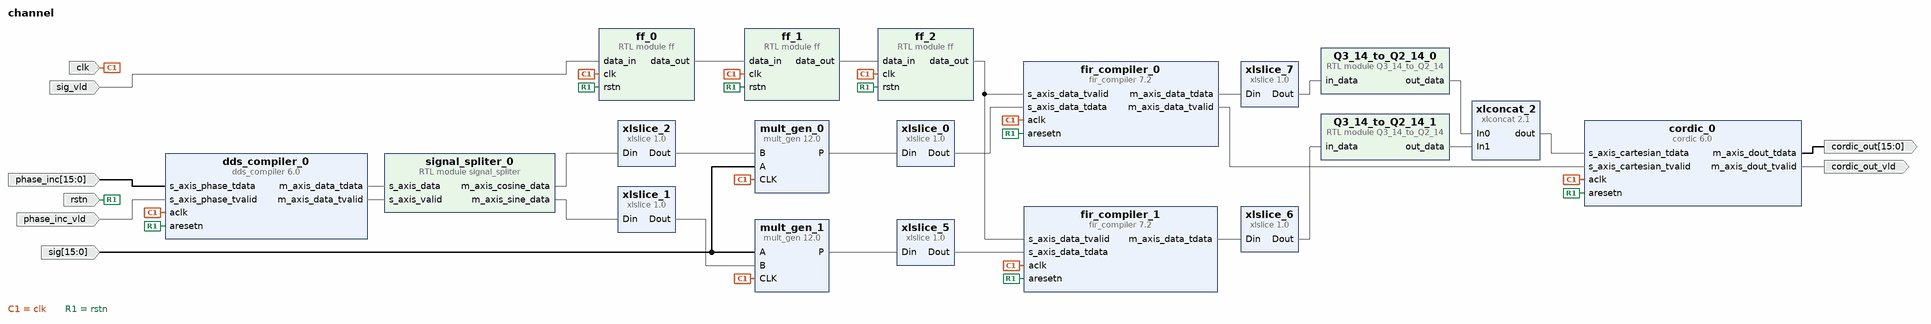
[diagram p0: block diagram of the top level]
# Vivado block design channel, xc7z010clg400-1, Vivado 2020.1
create_bd_design channel

create_bd_port -dir I -from 15 -to 0 phase_inc
create_bd_port -dir I phase_inc_vld
create_bd_port -dir O -from 15 -to 0 cordic_out
create_bd_port -dir O cordic_out_vld
create_bd_port -dir I -from 15 -to 0 sig
create_bd_port -dir I sig_vld
create_bd_port -dir I -type clk clk
set_property -dict {CONFIG.FREQ_HZ 125000000} [get_bd_ports clk]
create_bd_port -dir I -type rst rstn

create_bd_cell -type module -reference Q3_14_to_Q2_14 Q3_14_to_Q2_14_0
create_bd_cell -type module -reference Q3_14_to_Q2_14 Q3_14_to_Q2_14_1
create_bd_cell -type ip -vlnv xilinx.com:ip:cordic:6.0 cordic_0
set_property -dict [list \
  CONFIG.ARESETN true \
  CONFIG.Data_Format SignedFraction \
  CONFIG.Functional_Selection Arc_Tan \
  CONFIG.Input_Width 16 \
] [get_bd_cells cordic_0]
create_bd_cell -type ip -vlnv xilinx.com:ip:dds_compiler:6.0 dds_compiler_0
set_property -dict [list \
  CONFIG.Amplitude_Mode Full_Range \
  CONFIG.DATA_Has_TLAST Not_Required \
  CONFIG.DDS_Clock_Rate 125 \
  CONFIG.Frequency_Resolution 0.4 \
  CONFIG.Has_ACLKEN false \
  CONFIG.Has_ARESETn true \
  CONFIG.Has_Phase_Out false \
  CONFIG.Latency 7 \
  CONFIG.M_DATA_Has_TUSER Not_Required \
  CONFIG.Noise_Shaping None \
  CONFIG.Output_Frequency1 0 \
  CONFIG.Output_Width 16 \
  CONFIG.PINC1 0 \
  CONFIG.Parameter_Entry Hardware_Parameters \
  CONFIG.PartsPresent Phase_Generator_and_SIN_COS_LUT \
  CONFIG.Phase_Increment Streaming \
  CONFIG.Phase_Width 16 \
  CONFIG.S_PHASE_Has_TUSER Not_Required \
  CONFIG.Spurious_Free_Dynamic_Range 45 \
] [get_bd_cells dds_compiler_0]
create_bd_cell -type module -reference ff ff_0
create_bd_cell -type module -reference ff ff_1
create_bd_cell -type module -reference ff ff_2
create_bd_cell -type ip -vlnv xilinx.com:ip:fir_compiler:7.2 fir_compiler_0
set_property -dict [list \
  CONFIG.Channel_Sequence Basic \
  CONFIG.Clock_Frequency 125 \
  CONFIG.CoefficientVector {-0.036879, 0.014709, 0.012419, 0.010714, 0.009481, 0.008588, 0.007977, 0.007579, 0.007363, 0.007260, 0.007271, 0.007359, 0.007498, 0.007690, 0.007919, 0.008172, 0.008453, 0.008745, 0.009054, 0.009364, 0.009690, 0.010011, 0.010340, 0.010664, 0.010988, 0.011300, 0.011615, 0.011917, 0.012221, 0.012515, 0.012810, 0.013089, 0.013361, 0.013616, 0.013858, 0.014084, 0.014309, 0.014512, 0.014717, 0.014903, 0.015075, 0.015222, 0.015355, 0.015478, 0.015558, 0.015693, 0.015748, 0.015798, 0.015861, 0.015870, 0.015873, 0.015870, 0.015861, 0.015798, 0.015748, 0.015693, 0.015558, 0.015478, 0.015355, 0.015222, 0.015075, 0.014903, 0.014717, 0.014512, 0.014309, 0.014084, 0.013858, 0.013616, 0.013361, 0.013089, 0.012810, 0.012515, 0.012221, 0.011917, 0.011615, 0.011300, 0.010988, 0.010664, 0.010340, 0.010011, 0.009690, 0.009364, 0.009054, 0.008745, 0.008453, 0.008172, 0.007919, 0.007690, 0.007498, 0.007359, 0.007271, 0.007260, 0.007363, 0.007579, 0.007977, 0.008588, 0.009481, 0.010714, 0.012419, 0.014709, -0.036879} \
  CONFIG.Coefficient_Fractional_Bits 19 \
  CONFIG.Coefficient_Sets 1 \
  CONFIG.Coefficient_Sign Signed \
  CONFIG.Coefficient_Structure Inferred \
  CONFIG.Coefficient_Width 16 \
  CONFIG.ColumnConfig 40,11 \
  CONFIG.DATA_Has_TLAST Not_Required \
  CONFIG.Data_Fractional_Bits 14 \
  CONFIG.Data_Sign Signed \
  CONFIG.Data_Width 16 \
  CONFIG.Filter_Architecture Systolic_Multiply_Accumulate \
  CONFIG.Has_ARESETn true \
  CONFIG.M_DATA_Has_TUSER Not_Required \
  CONFIG.Number_Channels 1 \
  CONFIG.Output_Rounding_Mode Full_Precision \
  CONFIG.Output_Width 36 \
  CONFIG.Quantization Quantize_Only \
  CONFIG.S_DATA_Has_TUSER Not_Required \
  CONFIG.Sample_Frequency 125 \
  CONFIG.Select_Pattern All \
] [get_bd_cells fir_compiler_0]
create_bd_cell -type ip -vlnv xilinx.com:ip:fir_compiler:7.2 fir_compiler_1
set_property -dict [list \
  CONFIG.Channel_Sequence Basic \
  CONFIG.Clock_Frequency 125 \
  CONFIG.CoefficientVector {-0.036879, 0.014709, 0.012419, 0.010714, 0.009481, 0.008588, 0.007977, 0.007579, 0.007363, 0.007260, 0.007271, 0.007359, 0.007498, 0.007690, 0.007919, 0.008172, 0.008453, 0.008745, 0.009054, 0.009364, 0.009690, 0.010011, 0.010340, 0.010664, 0.010988, 0.011300, 0.011615, 0.011917, 0.012221, 0.012515, 0.012810, 0.013089, 0.013361, 0.013616, 0.013858, 0.014084, 0.014309, 0.014512, 0.014717, 0.014903, 0.015075, 0.015222, 0.015355, 0.015478, 0.015558, 0.015693, 0.015748, 0.015798, 0.015861, 0.015870, 0.015873, 0.015870, 0.015861, 0.015798, 0.015748, 0.015693, 0.015558, 0.015478, 0.015355, 0.015222, 0.015075, 0.014903, 0.014717, 0.014512, 0.014309, 0.014084, 0.013858, 0.013616, 0.013361, 0.013089, 0.012810, 0.012515, 0.012221, 0.011917, 0.011615, 0.011300, 0.010988, 0.010664, 0.010340, 0.010011, 0.009690, 0.009364, 0.009054, 0.008745, 0.008453, 0.008172, 0.007919, 0.007690, 0.007498, 0.007359, 0.007271, 0.007260, 0.007363, 0.007579, 0.007977, 0.008588, 0.009481, 0.010714, 0.012419, 0.014709, -0.036879} \
  CONFIG.Coefficient_Fractional_Bits 19 \
  CONFIG.Coefficient_Sets 1 \
  CONFIG.Coefficient_Sign Signed \
  CONFIG.Coefficient_Structure Inferred \
  CONFIG.Coefficient_Width 16 \
  CONFIG.ColumnConfig 40,11 \
  CONFIG.DATA_Has_TLAST Not_Required \
  CONFIG.Data_Fractional_Bits 14 \
  CONFIG.Data_Sign Signed \
  CONFIG.Data_Width 16 \
  CONFIG.Filter_Architecture Systolic_Multiply_Accumulate \
  CONFIG.Has_ARESETn true \
  CONFIG.M_DATA_Has_TUSER Not_Required \
  CONFIG.Number_Channels 1 \
  CONFIG.Output_Rounding_Mode Full_Precision \
  CONFIG.Output_Width 36 \
  CONFIG.Quantization Quantize_Only \
  CONFIG.S_DATA_Has_TUSER Not_Required \
  CONFIG.Sample_Frequency 125 \
  CONFIG.Select_Pattern All \
] [get_bd_cells fir_compiler_1]
create_bd_cell -type ip -vlnv xilinx.com:ip:mult_gen:12.0 mult_gen_0
set_property -dict [list \
  CONFIG.Multiplier_Construction Use_Mults \
  CONFIG.OutputWidthHigh 31 \
  CONFIG.PipeStages 3 \
  CONFIG.PortAType Signed \
  CONFIG.PortAWidth 16 \
  CONFIG.PortBType Signed \
  CONFIG.PortBWidth 16 \
  CONFIG.Use_Custom_Output_Width true \
] [get_bd_cells mult_gen_0]
create_bd_cell -type ip -vlnv xilinx.com:ip:mult_gen:12.0 mult_gen_1
set_property -dict [list \
  CONFIG.Multiplier_Construction Use_Mults \
  CONFIG.OutputWidthHigh 31 \
  CONFIG.PipeStages 3 \
  CONFIG.PortAType Signed \
  CONFIG.PortAWidth 16 \
  CONFIG.PortBType Signed \
  CONFIG.PortBWidth 16 \
  CONFIG.Use_Custom_Output_Width true \
] [get_bd_cells mult_gen_1]
create_bd_cell -type module -reference signal_spliter signal_spliter_0
create_bd_cell -type ip -vlnv xilinx.com:ip:xlconcat:2.1 xlconcat_2
set_property -dict {CONFIG.IN0_WIDTH 16 CONFIG.IN1_WIDTH 16} [get_bd_cells xlconcat_2]
create_bd_cell -type ip -vlnv xilinx.com:ip:xlslice:1.0 xlslice_0
set_property -dict {CONFIG.DIN_FROM 31 CONFIG.DIN_TO 16 CONFIG.DIN_WIDTH 32 CONFIG.DOUT_WIDTH 16} [get_bd_cells xlslice_0]
create_bd_cell -type ip -vlnv xilinx.com:ip:xlslice:1.0 xlslice_5
set_property -dict {CONFIG.DIN_FROM 31 CONFIG.DIN_TO 16 CONFIG.DIN_WIDTH 32 CONFIG.DOUT_WIDTH 16} [get_bd_cells xlslice_5]
create_bd_cell -type ip -vlnv xilinx.com:ip:xlslice:1.0 xlslice_6
set_property -dict {CONFIG.DIN_FROM 35 CONFIG.DIN_TO 19 CONFIG.DIN_WIDTH 40 CONFIG.DOUT_WIDTH 17} [get_bd_cells xlslice_6]
create_bd_cell -type ip -vlnv xilinx.com:ip:xlslice:1.0 xlslice_7
set_property -dict {CONFIG.DIN_FROM 35 CONFIG.DIN_TO 19 CONFIG.DIN_WIDTH 40 CONFIG.DOUT_WIDTH 17} [get_bd_cells xlslice_7]
create_bd_cell -type ip -vlnv xilinx.com:ip:xlslice:1.0 xlslice_1
set_property -dict {CONFIG.DIN_FROM 15 CONFIG.DOUT_WIDTH 16} [get_bd_cells xlslice_1]
create_bd_cell -type ip -vlnv xilinx.com:ip:xlslice:1.0 xlslice_2
set_property -dict {CONFIG.DIN_FROM 15 CONFIG.DOUT_WIDTH 16} [get_bd_cells xlslice_2]

# ---- connections ----

connect_bd_net [get_bd_pins ff_0/data_out] [get_bd_pins ff_1/data_in]
connect_bd_net [get_bd_pins ff_1/data_out] [get_bd_pins ff_2/data_in]
connect_bd_net [get_bd_pins ff_2/data_out] [get_bd_pins fir_compiler_0/s_axis_data_tvalid] [get_bd_pins fir_compiler_1/s_axis_data_tvalid]
connect_bd_net [get_bd_pins fir_compiler_0/m_axis_data_tdata] [get_bd_pins xlslice_7/Din]
connect_bd_net [get_bd_pins fir_compiler_0/m_axis_data_tvalid] [get_bd_pins cordic_0/s_axis_cartesian_tvalid]
connect_bd_net [get_bd_pins fir_compiler_1/m_axis_data_tdata] [get_bd_pins xlslice_6/Din]
connect_bd_net [get_bd_pins mult_gen_0/P] [get_bd_pins xlslice_0/Din]
connect_bd_net [get_bd_pins mult_gen_1/P] [get_bd_pins xlslice_5/Din]
connect_bd_net -net processing_system7_0_FCLK_CLK0 [get_bd_ports clk] \
  [get_bd_pins dds_compiler_0/aclk] [get_bd_pins fir_compiler_0/aclk] [get_bd_pins mult_gen_0/CLK] [get_bd_pins ff_0/clk] \
  [get_bd_pins ff_1/clk] [get_bd_pins ff_2/clk] [get_bd_pins mult_gen_1/CLK] [get_bd_pins fir_compiler_1/aclk] \
  [get_bd_pins cordic_0/aclk]
connect_bd_net -net rst_ps7_0_125M_peripheral_aresetn [get_bd_ports rstn] \
  [get_bd_pins dds_compiler_0/aresetn] [get_bd_pins fir_compiler_0/aresetn] [get_bd_pins ff_0/rstn] [get_bd_pins ff_1/rstn] \
  [get_bd_pins ff_2/rstn] [get_bd_pins fir_compiler_1/aresetn] [get_bd_pins cordic_0/aresetn]
connect_bd_net [get_bd_pins xlconcat_2/dout] [get_bd_pins cordic_0/s_axis_cartesian_tdata]
connect_bd_net [get_bd_pins xlslice_0/Dout] [get_bd_pins fir_compiler_0/s_axis_data_tdata]
connect_bd_net [get_bd_pins xlslice_5/Dout] [get_bd_pins fir_compiler_1/s_axis_data_tdata]
connect_bd_net [get_bd_pins xlslice_7/Dout] [get_bd_pins Q3_14_to_Q2_14_0/in_data]
connect_bd_net [get_bd_pins Q3_14_to_Q2_14_0/out_data] [get_bd_pins xlconcat_2/In0]
connect_bd_net [get_bd_pins Q3_14_to_Q2_14_1/out_data] [get_bd_pins xlconcat_2/In1]
connect_bd_net [get_bd_pins xlslice_6/Dout] [get_bd_pins Q3_14_to_Q2_14_1/in_data]
connect_bd_net [get_bd_pins dds_compiler_0/m_axis_data_tdata] [get_bd_pins signal_spliter_0/s_axis_data]
connect_bd_net [get_bd_pins dds_compiler_0/m_axis_data_tvalid] [get_bd_pins signal_spliter_0/s_axis_valid]
connect_bd_net [get_bd_pins signal_spliter_0/m_axis_sine_data] [get_bd_pins xlslice_1/Din]
connect_bd_net [get_bd_ports phase_inc] [get_bd_pins dds_compiler_0/s_axis_phase_tdata]
connect_bd_net [get_bd_ports phase_inc_vld] [get_bd_pins dds_compiler_0/s_axis_phase_tvalid]
connect_bd_net [get_bd_pins cordic_0/m_axis_dout_tdata] [get_bd_ports cordic_out]
connect_bd_net [get_bd_pins cordic_0/m_axis_dout_tvalid] [get_bd_ports cordic_out_vld]
connect_bd_net [get_bd_pins xlslice_2/Dout] [get_bd_pins mult_gen_0/B]
connect_bd_net [get_bd_pins xlslice_1/Dout] [get_bd_pins mult_gen_1/B]
connect_bd_net [get_bd_ports sig] [get_bd_pins mult_gen_0/A] [get_bd_pins mult_gen_1/A]
connect_bd_net [get_bd_ports sig_vld] [get_bd_pins ff_0/data_in]
connect_bd_net [get_bd_pins signal_spliter_0/m_axis_cosine_data] [get_bd_pins xlslice_2/Din]

validate_bd_design
save_bd_design
